# EAGLE board gdp (EAGLE 4.11)
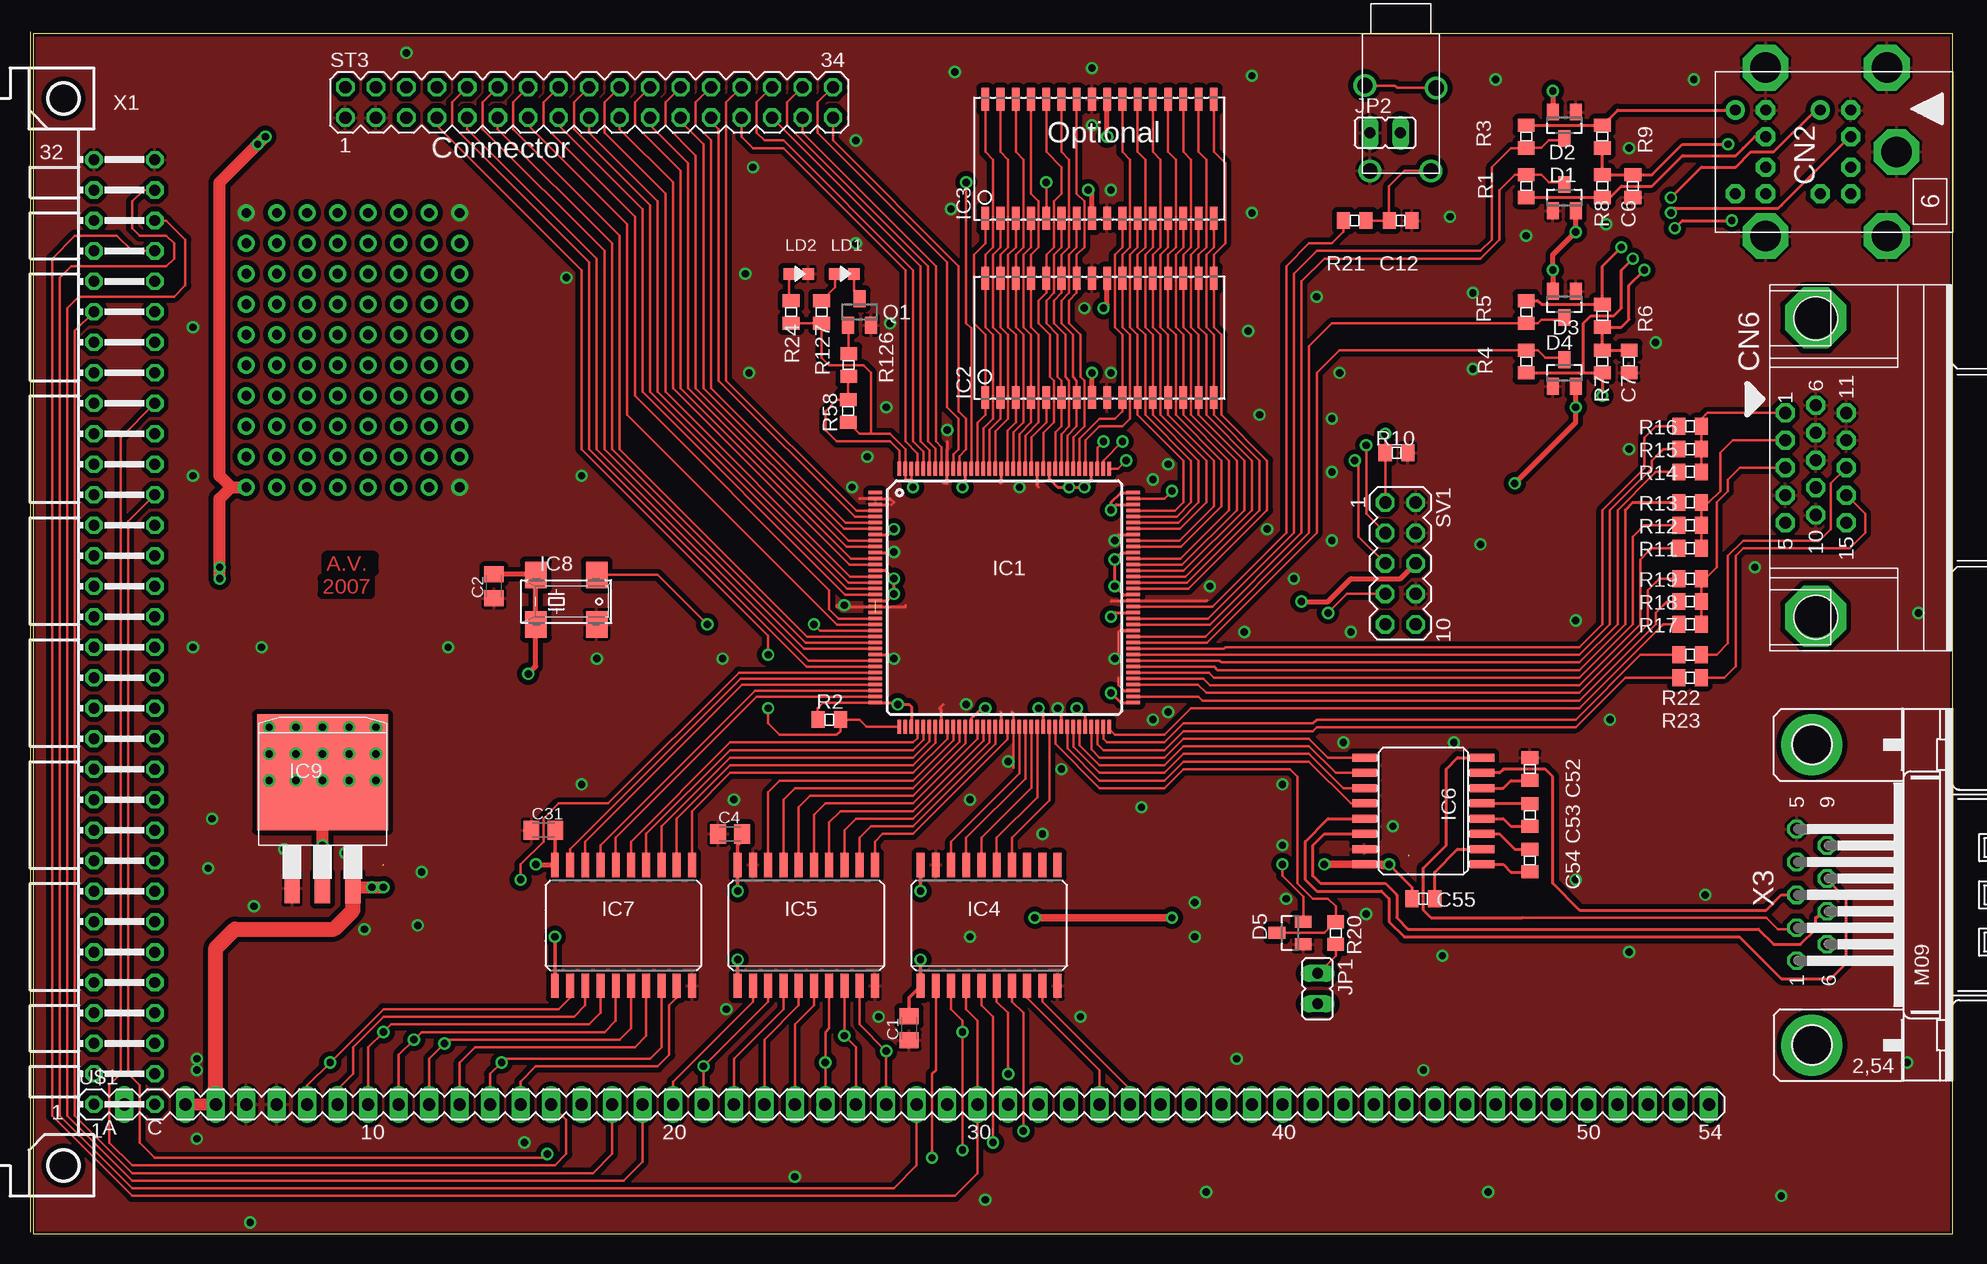
[diagram p2: board, top side]
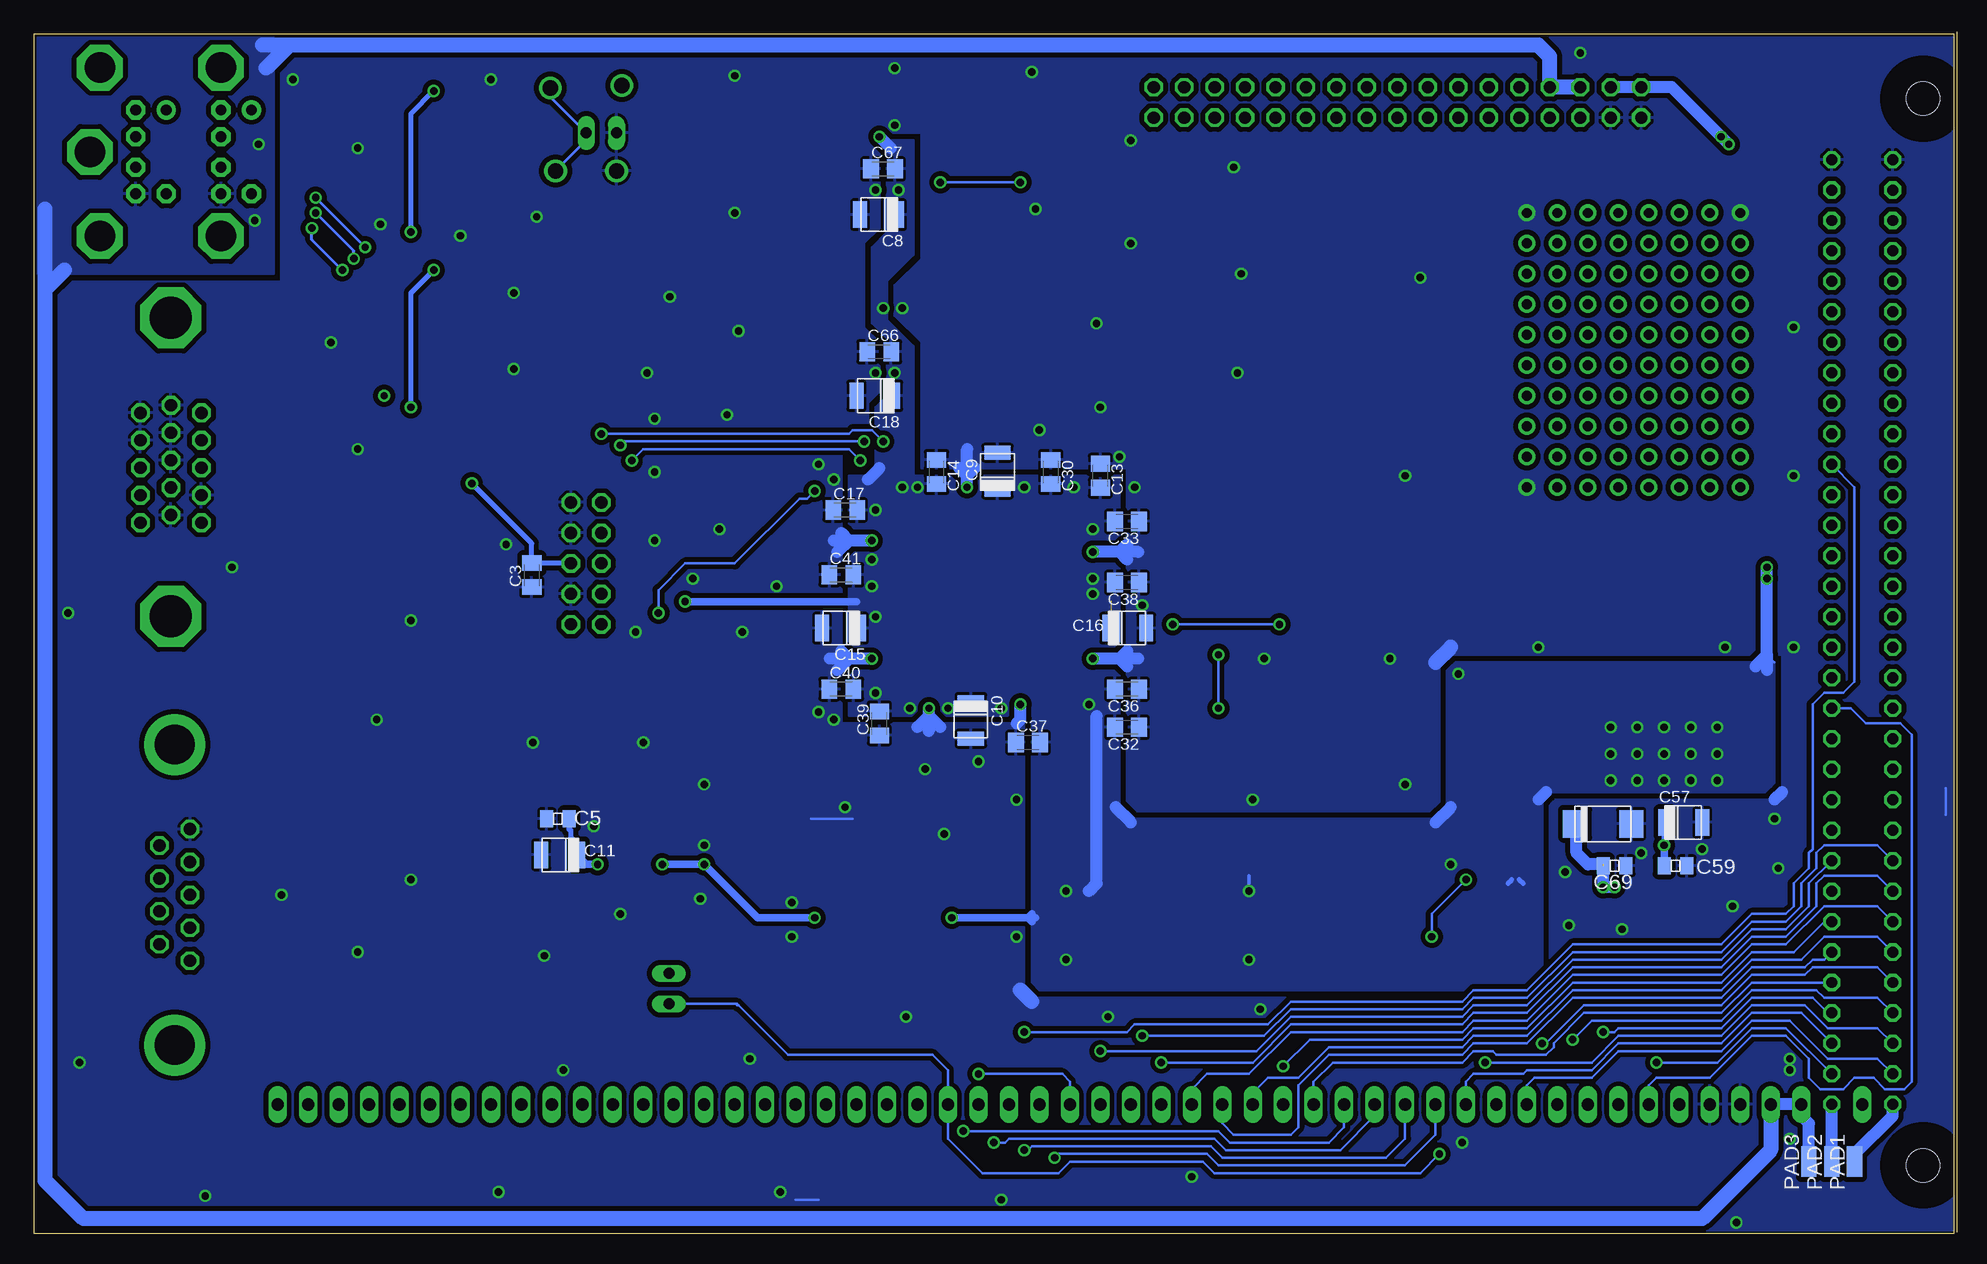
[diagram p3: board, bottom side, seen from below]

Size 160 x 100 mm. Coordinates in mm from the lower left corner, seen from the top.
Outline: 0,0 160,0 160,100 0,100 0,0
Copper layers (1*16): Top 0.035mm / dielectric 1.5mm / Bottom 0.035mm
Design rules "default": minimum track width 8mil, minimum drill 24mil, track to track 8mil, track to pad 8mil, pad to pad 8mil, via to via 8mil, smd to smd 8mil, copper to edge 0mil, drill to drill 8mil, minimum pad ring 10mil, minimum via ring 8mil, stop-mask expansion 4mil, vias tented up to drill 30mil, thermal gap 10mil

## Footprints (pad centres in the part's own frame; a part is rotated, then mirrored left to right if it is on the bottom)
C0805K = smd 1.3 x 1.6: 1 -1,0; 2 1,0
0805 = smd 1.092 x 1.397: 1 -0.94,0; 2 0.94,0
TANT_B = smd 1.15 x 2.2: 1 -1.473,0; 2 1.6,0
TANT_C = smd 2 x 2.3: 1 -2.032,0; 2 2.667,0
KLINKE3,5 = drill 1.27 round: 1 4.31,0.2; 2 11.43,0.635; 3 11.43,5.715; 4 4.51,6.15
MINIDIN_6POL_DOUBLE = drill 0.914 pad 1.6 octagon: A1 1.27,-8.5; A2 -1.27,-8.5; A3 3.493,-8.5; A4 -3.493,-8.5; A5 3.493,-11.04; B1 1.27,-15.6; B2 -1.27,-15.6; B3 3.493,-15.6; B4 -3.493,-15.6; B5 3.493,-18.14 | drill 0.914 pad 1.6 round: A6 -3.493,-11.04; B6 -3.493,-18.14 | drill 2.54 pad 3.81 octagon: SH1 0,-4.69; SH2 -7.018,-5.5; SH3 7.018,-5.5; SH4 -7.018,-15.6; SH5 7.018,-15.6
D-HD15F2 = drill 1.016 pad 1.575 octagon: 1 -4.826,-2.54; 2 -2.54,-2.54; 3 -0.254,-2.54; 4 2.032,-2.54; 5 4.318,-2.54; 6 -5.461,0; 7 -3.175,0; 8 -0.889,0; 9 1.397,0; 10 3.683,0; 11 -4.826,2.54; 12 -2.54,2.54; 13 -0.254,2.54; 14 2.032,2.54; 15 4.318,2.54 | drill 3.5 pad 5.08 octagon: PAD1 -12.754,0; PAD2 12.138,0
SOT23 = smd 1 x 1.4: 1 -0.95,-1.1; 2 0.95,-1.1; 3 0,1.1
TQFP144 = smd 1.143 x 0.297: 1 -10.75,8.75; 2 -10.75,8.25; 3 -10.75,7.75; 4 -10.75,7.25; 5 -10.75,6.75; 6 -10.75,6.25; 7 -10.75,5.75; 8 -10.75,5.25; 9 -10.75,4.75; 10 -10.75,4.25; 11 -10.75,3.75; 12 -10.75,3.25; 13 -10.75,2.75; 14 -10.75,2.25; 15 -10.75,1.75; 16 -10.75,1.25; 17 -10.75,0.75; 18 -10.75,0.25; 19 -10.75,-0.25; 20 -10.75,-0.75; 21 -10.75,-1.25; 22 -10.75,-1.75; 23 -10.75,-2.25; 24 -10.75,-2.75; 25 -10.75,-3.25; 26 -10.75,-3.75; 27 -10.75,-4.25; 28 -10.75,-4.75; 29 -10.75,-5.25; 30 -10.75,-5.75; 31 -10.75,-6.25; 32 -10.75,-6.75; 33 -10.75,-7.25; 34 -10.75,-7.75; 35 -10.75,-8.25; 36 -10.75,-8.75; 73 10.75,-8.75; 74 10.75,-8.25; 75 10.75,-7.75; 76 10.75,-7.25; 77 10.75,-6.75; 78 10.75,-6.25; 79 10.75,-5.75; 80 10.75,-5.25; 81 10.75,-4.75; 82 10.75,-4.25; 83 10.75,-3.75; 84 10.75,-3.25; 85 10.75,-2.75; 86 10.75,-2.25; 87 10.75,-1.75; 88 10.75,-1.25; 89 10.75,-0.75; 90 10.75,-0.25; 91 10.75,0.25; 92 10.75,0.75; 93 10.75,1.25; 94 10.75,1.75; 95 10.75,2.25; 96 10.75,2.75; 97 10.75,3.25; 98 10.75,3.75; 99 10.75,4.25; 100 10.75,4.75; 101 10.75,5.25; 102 10.75,5.75; 103 10.75,6.25; 104 10.75,6.75; 105 10.75,7.25; 106 10.75,7.75; 107 10.75,8.25; 108 10.75,8.75 | smd 0.297 x 1.143: 37 -8.75,-10.75; 38 -8.25,-10.75; 39 -7.75,-10.75; 40 -7.25,-10.75; 41 -6.75,-10.75; 42 -6.25,-10.75; 43 -5.75,-10.75; 44 -5.25,-10.75; 45 -4.75,-10.75; 46 -4.25,-10.75; 47 -3.75,-10.75; 48 -3.25,-10.75; 49 -2.75,-10.75; 50 -2.25,-10.75; 51 -1.75,-10.75; 52 -1.25,-10.75; 53 -0.75,-10.75; 54 -0.25,-10.75; 55 0.25,-10.75; 56 0.75,-10.75; 57 1.25,-10.75; 58 1.75,-10.75; 59 2.25,-10.75; 60 2.75,-10.75; 61 3.25,-10.75; 62 3.75,-10.75; 63 4.25,-10.75; 64 4.75,-10.75; 65 5.25,-10.75; 66 5.75,-10.75; 67 6.25,-10.75; 68 6.75,-10.75; 69 7.25,-10.75; 70 7.75,-10.75; 71 8.25,-10.75; 72 8.75,-10.75; 109 8.75,10.75; 110 8.25,10.75; 111 7.75,10.75; 112 7.25,10.75; 113 6.75,10.75; 114 6.25,10.75; 115 5.75,10.75; 116 5.25,10.75; 117 4.75,10.75; 118 4.25,10.75; 119 3.75,10.75; 120 3.25,10.75; 121 2.75,10.75; 122 2.25,10.75; 123 1.75,10.75; 124 1.25,10.75; 125 0.75,10.75; 126 0.25,10.75; 127 -0.25,10.75; 128 -0.75,10.75; 129 -1.25,10.75; 130 -1.75,10.75; 131 -2.25,10.75; 132 -2.75,10.75; 133 -3.25,10.75; 134 -3.75,10.75; 135 -4.25,10.75; 136 -4.75,10.75; 137 -5.25,10.75; 138 -5.75,10.75; 139 -6.25,10.75; 140 -6.75,10.75; 141 -7.25,10.75; 142 -7.75,10.75; 143 -8.25,10.75; 144 -8.75,10.75
SOJ32/4 = smd 0.635 x 1.905: 1 -8.89,-4.902; 2 -7.62,-4.902; 3 -6.35,-4.902; 4 -5.08,-4.902; 5 -3.81,-4.902; 6 -2.54,-4.902; 7 -1.27,-4.902; 8 0,-4.902; 9 1.27,-4.902; 10 2.54,-4.902; 11 3.81,-4.902; 12 5.08,-4.902; 13 6.35,-4.902; 14 7.62,-4.902; 15 8.89,-4.902; 16 10.16,-4.902; 17 10.16,5.029; 18 8.89,5.029; 19 7.62,5.029; 20 6.35,5.029; 21 5.08,5.029; 22 3.81,5.029; 23 2.54,5.029; 24 1.27,5.029; 25 0,5.029; 26 -1.27,5.029; 27 -2.54,5.029; 28 -3.81,5.029; 29 -5.08,5.029; 30 -6.35,5.029; 31 -7.62,5.029; 32 -8.89,5.029
SO20W = smd 0.66 x 2.032: 1 -5.715,-5.029; 2 -4.445,-5.029; 3 -3.175,-5.029; 4 -1.905,-5.029; 5 -0.635,-5.029; 6 0.635,-5.029; 7 1.905,-5.029; 8 3.175,-5.029; 9 4.445,-5.029; 10 5.715,-5.029; 11 5.715,5.029; 12 4.445,5.029; 13 3.175,5.029; 14 1.905,5.029; 15 0.635,5.029; 16 -0.635,5.029; 17 -1.905,5.029; 18 -3.175,5.029; 19 -4.445,5.029; 20 -5.715,5.029
SO16L = smd 0.66 x 2.032: 1 -4.445,-4.902; 2 -3.175,-4.902; 3 -1.905,-4.902; 4 -0.635,-4.902; 5 0.635,-4.902; 6 1.905,-4.902; 7 3.175,-4.902; 8 4.445,-4.902; 9 4.445,4.902; 10 3.175,4.902; 11 1.905,4.902; 12 0.635,4.902; 13 -0.635,4.902; 14 -1.905,4.902; 15 -3.175,4.902; 16 -4.445,4.902
CRYSTAL = smd 1.8 x 2.2: 1 -2.54,-2.857; 2 2.54,-2.857; 3 2.54,1.27; 4 -2.54,1.27
3LEAD_DD = smd 1.27 x 2.54: 1 -2.54,-3.556; 2 0,-3.556; 3 2.54,-3.556 | smd 10.922 x 9.652: 2@1 0,6.096
JP1 = drill 0.914 long: 1 0,-1.27; 2 0,1.27
0603LED = smd 0.965 x 0.965: 1 -0.787,0; 2 0.787,0
SMD2 = smd 1.27 x 2.54: 1 0,0
MA17-2 = drill 1.016 octagon: 1 -20.32,-1.27; 2 -20.32,1.27; 3 -17.78,-1.27; 4 -17.78,1.27; 5 -15.24,-1.27; 6 -15.24,1.27; 7 -12.7,-1.27; 8 -12.7,1.27; 9 -10.16,-1.27; 10 -10.16,1.27; 11 -7.62,-1.27; 12 -7.62,1.27; 13 -5.08,-1.27; 14 -5.08,1.27; 15 -2.54,-1.27; 16 -2.54,1.27; 17 0,-1.27; 18 0,1.27; 19 2.54,-1.27; 20 2.54,1.27; 21 5.08,-1.27; 22 5.08,1.27; 23 7.62,-1.27; 24 7.62,1.27; 25 10.16,-1.27; 26 10.16,1.27; 27 12.7,-1.27; 28 12.7,1.27; 29 15.24,-1.27; 30 15.24,1.27; 31 17.78,-1.27; 32 17.78,1.27; 33 20.32,-1.27; 34 20.32,1.27
MA05-2 = drill 1.016 octagon: 1 -5.08,-1.27; 2 -5.08,1.27; 3 -2.54,-1.27; 4 -2.54,1.27; 5 0,-1.27; 6 0,1.27; 7 2.54,-1.27; 8 2.54,1.27; 9 5.08,-1.27; 10 5.08,1.27
NKC-BUS = drill 1.016 long: 2 2.54,0; 4 7.62,0; 5 10.16,0; 6 12.7,0; 7 15.24,0; 8 17.78,0; 9 20.32,0; 10 22.86,0; 11 25.4,0; 12 27.94,0; 13 30.48,0; 14 33.02,0; 15 35.56,0; 16 38.1,0; 17 40.64,0; 18 43.18,0; 19 45.72,0; 20 48.26,0; 21 50.8,0; 22 53.34,0; 23 55.88,0; 24 58.42,0; 25 60.96,0; 26 63.5,0; 27 66.04,0; 28 68.58,0; 29 71.12,0; 30 73.66,0; 31 76.2,0; 32 78.74,0; 33 81.28,0; 34 83.82,0; 35 86.36,0; 36 88.9,0; 37 91.44,0; 38 93.98,0; 39 96.52,0; 40 99.06,0; 41 101.6,0; 42 104.14,0; 43 106.68,0; 44 109.22,0; 45 111.76,0; 46 114.3,0; 47 116.84,0; 48 119.38,0; 49 121.92,0; 50 124.46,0; 51 127,0; 52 129.54,0; 53 132.08,0; 54 134.62,0
ML64ECB = drill 0.914 octagon: 10C -7.62,16.51; 11C -7.62,13.97; 12A -2.54,11.43; 12C -7.62,11.43; 13A -2.54,8.89; 13C -7.62,8.89; 14A -2.54,6.35; 15A -2.54,3.81; 15C -7.62,3.81; 16A -2.54,1.27; 16C -7.62,1.27; 17A -2.54,-1.27; 19A -2.54,-6.35; 19C -7.62,-6.35; 21A -2.54,-11.43; 22A -2.54,-13.97; 23A -2.54,-16.51; 23C -7.62,-16.51; 24A -2.54,-19.05; 25A -2.54,-21.59; 26A -2.54,-24.13; 26C -7.62,-24.13; +5V -2.54,39.37; +5V@1 -7.62,39.37; A0 -7.62,29.21; A1 -7.62,24.13; A2 -2.54,26.67; A3 -7.62,26.67; A4 -2.54,24.13; A5 -2.54,21.59; A6 -2.54,19.05; A7 -7.62,19.05; A8 -7.62,21.59; A9 -2.54,-34.29; A10 -7.62,-3.81; A11 -7.62,-1.27; A12 -7.62,-26.67; A13 -2.54,-31.75; A14 -2.54,-3.81; A15 -7.62,-29.21; BUSAK -2.54,-36.83; BUSRQ -2.54,13.97; CLK -7.62,-31.75; D0 -7.62,36.83; D1 -7.62,6.35; D2 -7.62,31.75; D3 -2.54,31.75; D4 -2.54,29.21; D5 -2.54,36.83; D6 -2.54,34.29; D7 -7.62,34.29; GND -2.54,-39.37; GND@1 -7.62,-39.37; HALT -7.62,-21.59; INT -7.62,-11.43; IORQ -2.54,-26.67; M1 -2.54,-8.89; MREQ -7.62,-34.29; NMI -7.62,-8.89; RD -7.62,-19.05; RESET -7.62,-36.83; RFSH -2.54,-29.21; WAIT -2.54,16.51; WR -7.62,-13.97 | hole 2.794: 0,44.45; 0,-44.45
M09HP = drill 1.016 octagon: 1 5.486,-1.27; 2 2.743,-1.27; 3 0,-1.27; 4 -2.743,-1.27; 5 -5.486,-1.27; 6 4.115,1.27; 7 1.372,1.27; 8 -1.372,1.27; 9 -4.115,1.27 | drill 3.302 pad 5.08 round: G1 12.522,0; G2 -12.522,0

## Placement (x,y rotation side)
C1  100n  [C0805K]  73.03,17.14 90 top
C2  100n  [C0805K]  38.42,53.98 90 top
C3  100n  [C0805K]  118.51,54.9 90 bottom
C4  100n  [C0805K]  58.1,33.34 0 top
C5  100n  [0805]  116.33,34.61 0 bottom
C6  100n  [0805]  133.35,87.31 90 top
C7  100n  [0805]  133.03,72.71 90 top
C8  10µF  [TANT_B]  89.55,84.95 180 bottom
C9  10µF  [TANT_B]  79.69,63.5 90 bottom
C10  10µF  [TANT_B]  81.92,42.86 270 bottom
C11  10µF  [TANT_B]  116.12,31.59 180 bottom
C12  4n7  [0805]  113.98,84.45 180 top
C13  100n  [C0805K]  71.12,63.18 270 bottom
C14  100n  [C0805K]  84.77,63.5 270 bottom
C15  10µF  [TANT_B]  92.71,50.48 180 bottom
C16  10µF  [TANT_B]  68.9,50.48 0 bottom
C17  100n  [C0805K]  92.39,60.33 0 bottom
C18  10µF  [TANT_B]  89.85,69.85 180 bottom
C30  100n  [C0805K]  75.25,63.5 270 bottom
C31  100n  [C0805K]  42.55,33.66 0 top
C32  100n  [C0805K]  68.9,42.23 180 bottom
C33  100n  [C0805K]  68.9,59.37 180 bottom
C36  100n  [C0805K]  68.9,45.4 180 bottom
C37  100n  [C0805K]  77.15,40.96 0 bottom
C38  100n  [C0805K]  68.9,54.29 180 bottom
C39  100n  [C0805K]  89.53,42.55 90 bottom
C40  100n  [C0805K]  92.71,45.4 0 bottom
C41  100n  [C0805K]  92.71,54.93 0 bottom
C52  100n  [0805]  124.78,38.73 270 top
C53  100n  [0805]  124.78,34.92 270 top
C54  100n  [0805]  124.78,31.11 270 top
C55  100n  [0805]  115.89,27.94 180 top
C57  10µF  [TANT_B]  22.54,34.29 0 bottom
C59  100n  [0805]  23.18,30.68 180 bottom
C63  10µF/16V  [TANT_C]  29.53,34.18 0 bottom
C66  100n  [C0805K]  89.55,73.52 0 bottom
C67  100n  [C0805K]  89.23,88.76 0 bottom
C69  100n  [0805]  28.26,30.68 180 bottom
CN1  LINE OUT  [KLINKE3,5]  110.81,100.01 270 top
CN2  [MINIDIN_6POL_DOUBLE]  160.02,90.17 270 top
CN6  VGA15  [D-HD15F2]  148.59,63.59 270 top
D1  BAT54S  [SOT23]  127.64,86.36 0 top
D2  BAT54S  [SOT23]  127.64,92.39 180 top
D3  BAT54S  [SOT23]  127.64,77.47 180 top
D4  BAT54S  [SOT23]  127.64,71.75 0 top
D5  BAT54S  [SOT23]  104.78,25.08 90 top
IC1  LFXP6KC-T144  [TQFP144]  80.96,53.02 0 top
IC2  CY7C1019CV33-12VC  [SOJ32/4]  88.27,74.61 0 top
IC3  CY7C1019CV33-12VC  [SOJ32/4]  88.27,89.53 0 top
IC4  74LVC245  [SO20W]  79.69,25.72 0 top
IC5  74LVC245  [SO20W]  64.45,25.72 0 top
IC6  MAX3232CSE  [SO16L]  115.89,35.24 90 top
IC7  74LVC245  [SO20W]  49.21,25.72 0 top
IC8  40MHz  [CRYSTAL]  44.45,53.66 0 top
IC9  LT1086CM-3.3  [3LEAD_DD]  24.13,32.38 0 top
JP1  [JP1]  107.08,20.44 180 top
JP2  [JP1]  112.71,91.76 270 top
LD1  gelb  [0603LED]  67.63,80.01 0 top
LD2  Grün  [0603LED]  63.82,80.01 0 top
PAD1  [SMD2]  8.26,6.03 0 bottom
PAD2  [SMD2]  10.16,6.03 0 bottom
PAD3  [SMD2]  12.06,6.03 0 bottom
Q1  BSS138  [SOT23]  68.9,76.83 0 top
R1  120  [0805]  124.46,87.31 270 top
R2  4k7  [0805]  66.36,42.86 180 top
R3  120  [0805]  124.46,91.44 90 top
R4  120  [0805]  124.46,72.71 270 top
R5  120  [0805]  124.46,76.83 90 top
R6  2k  [0805]  130.81,76.52 270 top
R7  2k  [0805]  130.81,72.71 90 top
R8  2k  [0805]  130.81,87.31 90 top
R9  2k  [0805]  130.81,91.44 270 top
R10  4k7  [0805]  113.64,65.11 180 top
R11  470  [0805]  138.11,57.15 180 top
R12  1k  [0805]  138.11,59.05 180 top
R13  1k8  [0805]  138.11,60.96 180 top
R14  470  [0805]  138.11,63.5 180 top
R15  1k  [0805]  138.11,65.41 180 top
R16  1k8  [0805]  138.11,67.31 180 top
R17  470  [0805]  138.11,50.8 180 top
R18  1k  [0805]  138.11,52.7 180 top
R19  1k8  [0805]  138.11,54.61 180 top
R20  120R  [0805]  108.58,25.08 90 top
R21  3k3  [0805]  110.17,84.45 180 top
R22  47  [0805]  138.11,48.26 180 top
R23  47  [0805]  138.11,46.35 180 top
R24  270R  [0805]  63.18,76.83 270 top
R58  10k  [0805]  67.94,68.58 270 top
R126  5K6  [0805]  67.99,72.42 90 top
R127  220R  [0805]  65.72,76.83 270 top
ST3  [MA17-2]  46.35,94.3 0 top
SV1  [MA05-2]  113.98,55.88 270 top
U$1  NKC-BUS  [NKC-BUS]  5.08,10.79 0 top
X1  ECB64  [ML64ECB]  2.54,50.16 180 top
X3  DB9-M  [M09HP]  148.27,28.26 270 top

## Tracks (layer width: path | path; a pad name or v marks a point on that pad's centre or on a via)
/BUS_INT  (via drill 0.61)
  Top 0.203: X1.INT 7.94,59.37 7.94,13.34 8.89,12.38 8.89,7.62 10.16,6.35 42.55,6.35 v42.86,6.67
  Bottom 0.203: JP1.2 101.4,19.17 101.4,19.05 101.28,19.05 97.16,14.92 85.09,14.92 83.82,13.65 U$1.32 83.82,7.94 80.96,5.08 74.61,5.08 73.66,6.03 62.55,6.03 61.59,5.08 44.45,5.08 v42.86,6.67
A0
  Top 0.203: 60.01,20.32 60.01,20 | 60.01,20.32 IC5.2 | 60.01,20.32 60.01,19.37 53.34,12.7 U$1.20
  Bottom 0.203: X1.A0 16.83,20.95 19.37,18.41 30.8,18.41 33.34,15.88 33.34,15.56 33.97,14.92 38.1,14.92 38.42,15.24 40.01,15.24 40.96,14.29 51.75,14.29 53.34,12.7 U$1.20
A1  (via drill 0.61)
  Top 0.203: IC5.3 61.28,19.37 v55.88,13.97 U$1.21
  Bottom 0.203: X1.A1 10.79,26.04 13.34,23.5 16.83,23.5 19.37,20.95 31.75,20.95 35.56,17.14 40.01,17.14 40.96,16.19 53.66,16.19 v55.88,13.97
A2
  Top 0.203: IC5.4 62.55,18.73 58.42,14.61 U$1.22
  Bottom 0.203: X1.A2 6.35,24.77 10.79,24.77 12.7,22.86 16.83,22.86 19.37,20.32 31.75,20.32 35.56,16.51 40.01,16.51 40.96,15.56 52.07,15.56 54.61,13.02 57.15,13.02 58.42,11.75 U$1.22
A3
  Top 0.203: IC5.5 63.82,19.05 60.96,16.19 U$1.23
  Bottom 0.203: X1.A3 10.79,22.86 11.75,22.86 12.38,22.23 16.83,22.23 19.37,19.68 31.75,19.68 35.56,15.88 40.01,15.88 40.96,14.92 52.07,14.92 54.61,12.38 54.61,8.89 55.24,8.26 60.01,8.26 60.96,9.21 U$1.23
A4
  Top 0.203: IC5.6 65.09,19.05 63.5,17.46 U$1.24
  Bottom 0.203: X1.A4 6.35,27.3 10.79,27.3 13.97,24.13 16.83,24.13 19.37,21.59 31.75,21.59 35.56,17.78 40.01,17.78 40.96,16.83 55.24,16.83 58.74,13.34 62.23,13.34 63.5,12.06 U$1.24
A5  (via drill 0.61)
  Top 0.203: U$1.25 v66.04,14.29 66.04,16.83 66.36,17.14 IC5.7
  Bottom 0.203: X1.A5 6.35,29.84 10.79,29.84 11.43,29.21 11.43,27.3 13.97,24.77 16.83,24.77 19.37,22.23 31.75,22.23 35.56,18.41 40.01,18.41 40.96,17.46 55.24,17.46 58.42,14.29 v66.04,14.29
A6  (via drill 0.61)
  Top 0.203: U$1.26 68.58,15.56 v67.63,16.51 IC5.8
  Bottom 0.203: X1.A6 6.35,32.38 10.79,32.38 11.43,31.75 11.43,30.48 12.7,29.21 12.7,27.3 13.97,26.04 16.83,26.04 19.37,23.5 31.75,23.5 35.56,19.68 40.01,19.68 40.96,18.73 55.24,18.73 57.47,16.51 v67.63,16.51
A7  (via drill 0.61)
  Top 0.203: U$1.27 v71.12,15.24 68.9,17.46 IC5.9
  Bottom 0.203: v71.12,15.24 58.1,15.24 55.24,18.1 40.96,18.1 40.01,19.05 35.56,19.05 31.75,22.86 19.37,22.86 16.83,25.4 13.97,25.4 12.06,27.3 12.06,29.21 X1.A7
A8
  Top 0.203: IC4.8 82.87,19.68 88.9,13.65 U$1.34
A9
  Top 0.203: U$1.35 91.44,12.06 84.14,19.37 IC4.9
AUDIO
  Top 0.203: IC1.89 98.31,52.27 104.46,58.42 104.46,80.64 106.36,82.55 108.27,82.55 109.23,83.52 R21.2
BLAU
  Top 0.203: R17.1 139.06,50.8 139.05,50.81 R18.1 139.06,52.7 139.05,52.72 R19.1 139.38,54.61 140.34,55.56 140.34,60.96 141.29,61.91 141.29,62.87 142.27,63.85 CN6.3
CLK
  Top 0.203: X1.CLK 8.26,81.92 6.99,83.19 3.49,83.19 1.59,81.28 1.59,9.84 8.26,3.17 76.83,3.17 78.74,5.08 U$1.30 78.74,17.78 77.79,18.73 IC4.4
CTS_FPGA
  Top 0.203: IC6.12 109.86,35.88 106.36,39.37 95.89,39.37 94.3,37.78 88.9,37.78 86.21,40.47 IC1.65
D0  (via drill 0.61)
  Top 0.203: IC7.2 44.77,19.68 43.81,18.73 29.21,18.73 v24.77,14.29 22.86,12.38 22.86,11.11 | 22.86,11.11 U$1.8 | 22.86,11.11 22.86,11.43
  Bottom 0.203: X1.D0 13.97,17.14 16.83,17.14 19.68,14.29 v24.77,14.29
D1
  Top 0.203: IC7.3 46.04,19.05 45.09,18.1 29.21,18.1 26.67,15.56 26.67,13.34 25.4,12.06 U$1.9
  Bottom 0.203: 9.53,43.81 X1.D1 8.57,43.81 7.3,42.55 4.45,42.55 3.49,41.59 3.49,12.7 4.13,12.06 5.71,12.06 6.67,13.02 8.26,13.02 9.21,12.06 11.11,12.06 12.06,13.02 12.06,14.61 13.97,16.51 16.83,16.51 20.32,13.02 24.77,13.02 25.4,12.38 U$1.9
D2  (via drill 0.61)
  Top 0.203: U$1.10 27.94,15.56 v29.21,16.83 29.84,17.46 46.35,17.46 47.31,18.41 IC7.4
  Bottom 0.203: X1.D2 10.48,18.41 11.75,19.68 16.83,19.68 19.37,17.14 27.94,17.14 28.26,16.83 v29.21,16.83
D3  (via drill 0.61)
  Top 0.203: IC7.5 48.58,17.78 47.62,16.83 32.38,16.83 v31.75,16.19 30.48,14.92 U$1.11
  Bottom 0.203: X1.D3 6.35,19.68 10.79,19.68 11.43,20.32 16.83,20.32 19.37,17.78 30.16,17.78 v31.75,16.19
D4  (via drill 0.61)
  Top 0.203: U$1.12 33.02,14.61 v34.29,15.88 34.61,16.19 48.9,16.19 49.85,17.14 IC7.6
  Bottom 0.203: X1.D4 6.35,22.23 11.75,22.23 12.38,21.59 16.83,21.59 19.37,19.05 30.8,19.05 33.97,15.88 v34.29,15.88
D5
  Top 0.203: IC7.7 51.12,16.51 50.16,15.56 36.83,15.56 35.56,14.29 U$1.13
  Bottom 0.203: X1.D5 6.35,14.61 10.48,14.61 13.65,17.78 16.83,17.78 19.37,15.24 27.94,15.24 30.16,13.02 34.92,13.02 35.56,12.38 U$1.13
D6  (via drill 0.61)
  Top 0.203: U$1.14 38.1,13.34 v39.05,14.29 39.37,14.61 51.44,14.61 52.39,15.56 IC7.8
  Bottom 0.203: X1.D6 6.35,17.14 10.48,17.14 12.38,19.05 16.83,19.05 19.37,16.51 27.94,16.51 30.16,14.29 v39.05,14.29
D7
  Top 0.203: U$1.15 40.64,12.7 41.91,13.97 52.07,13.97 53.02,14.92 53.02,19.05 53.66,19.68 IC7.9
  Bottom 0.203: X1.D7 12.7,18.41 16.83,18.41 19.37,15.88 27.94,15.88 30.16,13.65 35.56,13.65 35.88,13.34 40.01,13.34 40.64,12.7 U$1.15
DONE
  Top 0.203: R126.1 67.94,71.47 67.94,69.53 | IC1.144 72.21,65.27 71.44,66.04 66.99,66.04 66.04,66.99 66.04,68.58 66.99,69.53 67.94,69.53 | 67.94,69.53 R58.1
EXT0
  Top 0.203: ST3.10 34.92,94.3 34.92,92.39 46.35,80.96 46.35,65.41 64.49,47.27 IC1.30
EXT1
  Top 0.203: IC1.29 64.62,47.77 46.99,65.41 46.99,81.28 36.2,92.08 ST3.9
EXT2
  Top 0.203: ST3.12 37.47,94.3 37.47,92.08 47.62,81.92 47.62,65.41 64.26,48.77 IC1.27
EXT3
  Top 0.203: IC1.26 64.39,49.27 48.26,65.41 48.26,82.55 38.73,92.08 ST3.11
EXT4
  Top 0.203: ST3.14 40.01,94.3 40.01,92.08 48.9,83.19 48.9,65.41 64.53,49.77 IC1.25
EXT5
  Top 0.203: IC1.23 67.02,50.77 49.53,68.26 49.53,84.14 41.27,92.39 ST3.13
EXT6
  Top 0.203: ST3.16 42.55,94.3 42.55,92.39 50.16,84.77 50.16,69.85 66.36,53.66 66.36,52.07 67.16,51.27 IC1.22
EXT7
  Top 0.203: IC1.18 67.69,53.27 50.8,70.17 50.8,85.41 43.81,92.39 ST3.15
EXT8
  Top 0.203: IC1.17 67.83,53.77 51.44,70.17 51.44,85.72 45.09,92.08 45.09,94.3 ST3.18
EXT9
  Top 0.203: IC1.16 67.97,54.27 52.07,70.17 52.07,86.04 46.35,91.76 ST3.17
EXT10
  Top 0.203: IC1.15 68.1,54.77 52.7,70.17 52.7,86.68 47.62,91.76 47.62,94.3 ST3.20
EXT11
  Top 0.203: IC1.13 68.05,55.77 53.34,70.48 53.34,87.63 48.9,92.08 ST3.19
EXT12
  Top 0.203: ST3.22 50.16,94.3 50.16,92.39 53.98,88.58 53.98,70.48 68.19,56.27 IC1.12
EXT13
  Top 0.203: IC1.10 67.82,57.27 54.61,70.48 54.61,89.22 51.44,92.39 ST3.21
EXT14
  Top 0.203: ST3.24 52.7,94.3 52.7,92.39 55.24,89.85 55.24,70.48 67.96,57.77 IC1.9
EXT15
  Top 0.203: IC1.7 67.59,58.77 55.88,70.48 55.88,90.81 53.98,92.71 ST3.23
EXT16
  Top 0.203: IC1.6 67.73,59.27 56.52,70.48 56.52,91.12 55.24,92.39 55.24,94.3 ST3.26
EXT17
  Top 0.203: IC1.5 68.5,59.77 57.15,71.12 57.15,92.08 56.52,92.71 ST3.25
EXT18
  Top 0.203: IC1.4 68.63,60.27 57.78,71.12 57.78,94.3 ST3.28
EXT19
  Top 0.203: ST3.27 59.05,91.44 60.01,90.49 62.55,90.49 72.71,80.33 72.71,66.04 73.71,65.03 IC1.141
EXT20
  Top 0.203: ST3.30 60.33,94.3 60.33,91.76 60.96,91.12 62.55,91.12 73.34,80.33 73.34,66.04 74.21,65.17 IC1.140
EXT21
  Top 0.203: ST3.29 73.98,80.64 73.98,66.04 74.71,65.31 IC1.139
EXT22
  Top 0.203: ST3.32 62.87,94.3 62.87,92.39 74.61,80.64 74.61,66.04 75.21,65.44 IC1.138
EXT23
  Top 0.203: ST3.31 64.14,91.76 75.25,80.64 75.25,66.04 75.71,65.58 IC1.137
EXT24
  Top 0.203: ST3.34 65.41,94.3 65.41,91.76 76.2,80.96 76.2,68.9 77.15,67.94 77.15,65.41 76.71,64.97 IC1.135
EXT25
  Top 0.203: ST3.33 66.67,91.12 77.15,80.64 77.15,68.58 77.79,67.94 77.79,65.41 77.21,64.83 IC1.134
F_TCK  (via drill 0.61)
  Top 0.203: IC1.111 88.71,65.53 v89.22,66.04 | v112.71,66.67 112.71,65.09 | R10.2 SV1.1
  Top 0.254: 112.71,65.09 112.7,65.09 R10.2 | SV1.1
  Bottom 0.203: v112.71,66.67 92.08,66.67 91.76,66.99 90.17,66.99 v89.22,66.04
F_TDI  (via drill 0.61)
  Top 0.203: IC1.109 90.44,63.77 v91.12,64.45 | SV1.5 110.49,58.1 110.49,64.14 v110.17,64.45
  Bottom 0.203: v91.12,64.45 92.08,65.41 109.22,65.41 v110.17,64.45
F_TDO  (via drill 0.61)
  Top 0.203: SV1.7 109.54,53.34 v107.95,51.75 | IC1.107 94.29,61.27 v94.93,61.91
  Bottom 0.203: v107.95,51.75 107.95,53.66 105.73,55.88 101.6,55.88 96.2,61.28 95.57,61.28 v94.93,61.91
F_TMS  (via drill 0.61)
  Top 0.203: SV1.3 111.12,60.01 v111.12,65.72 | v90.81,66.04 89.22,64.45 89.22,63.82 89.21,63.82 IC1.110
  Bottom 0.203: v90.81,66.04 110.81,66.04 v111.12,65.72
GND  (via drill 0.61, 0.81 pad 1.42)
  Top 0.203: 90.49,58.1 90.49,58.27 | 83.71,62.34 83.82,62.23 | 80.64,62.55 80.71,62.62 | 75.88,62.55 76.04,62.71 76.21,62.88 | 71.44,61.28 71.43,61.27 71.44,61.27 71.75,60.96 71.57,60.77 | 68.9,61.27 68.9,61.28 | 75.71,43.67 75.56,43.81 | 80.71,43.43 80.64,43.5 | 90.94,45.27 90.49,45.72 90.49,46.35 | 90.49,48.26 90.49,50.16 90.59,50.27 90.7,50.27 90.81,50.27 | 71.75,48.27 71.75,48.26 | 66.99,52.27 66.99,52.39 | 72.71,52.27 72.71,52.39 | 81.71,38.85 IC1.56 81.71,43.38 81.6,43.5
  Top 0.254: 75.88,44.13 75.71,43.96 | IC1.11 71.38,56.77 71.44,56.83 | 90.49,58.27 IC1.101 | 83.71,62.34 IC1.121 | 80.71,62.62 IC1.127 | 71.43,61.27 IC1.2 68.9,61.27 | IC1.44 75.71,43.67 | IC1.54 80.71,43.43 | 90.94,45.27 IC1.75 | IC1.28 71.75,48.27 | 66.99,52.27 IC1.20 72.71,52.27 | 90.91,50.27 IC1.85 90.7,50.27 | IC1.64 85.71,43.48 | 97.86,52.77 IC1.90 89.92,52.77 89.85,52.7 | IC1.3 71.31,60.77 | IC2.9 89.55,69.71 | IC1.136 76.21,66.03 | 76.04,62.71 76.04,62.55 76.2,62.55 76.2,65.41
  Top 0.305: 85.71,43.48 85.72,43.5
  Top 0.406: D3.1 128.59,78.74
  Bottom 0.203: 91.76,34.61 95.25,34.61 | 0.64,34.92 0.64,37.15 | 94.61,2.86 96.52,2.86
  Bottom 1.016: v77.79,44.13 77.79,42.86 78.11,42.55 | 67.94,47.94 69.53,47.94 | 67.94,56.83 69.53,56.83 | 69.53,56.83 v71.75,56.83 | v82.23,62.23 82.23,65.41 | v90.17,57.78 92.08,57.78 | 92.08,57.78 93.34,57.78 | v90.17,47.94 92.08,47.94 | 92.08,47.94 93.66,47.94 | 85.41,43.18 85.41,41.91 | 85.41,43.18 v85.41,43.81 | 84.45,42.23 85.41,43.18 | 85.41,43.18 86.36,42.23 | 92.08,47.94 93.03,46.99 | 92.08,47.94 92.71,48.58 | 92.08,57.78 93.03,56.83 | 92.08,57.78 92.71,58.42 | 81.6,63.82 82.23,63.18 82.87,63.82 | 69.53,56.83 68.9,57.47 | 69.53,56.83 68.9,56.2 | 69.53,47.94 68.9,48.58 | 69.53,47.94 68.9,47.31 | 14.29,36.83 14.92,36.2 | 69.53,47.94 v71.75,47.94
  Bottom 1.27: 43.18,47.62 41.91,48.9 | 76.83,19.37 77.79,20.32
  other vias: 45.72,63.18 93.34,42.86 59.69,71.75 115.89,13.65 92.39,35.56 100.33,14.61 44.45,79.69 94.61,64.14 89.85,87 88.27,92.39 120.02,72.07 89.85,71.75 87.63,77.15 124.46,83.19 108.27,63.5 108.27,57.78 101.28,75.25 101.6,85.09 120.02,78.42 118.11,84.77 121.92,96.2 96.84,27.62 96.84,24.77 111.12,26.67 97.79,3.49 121.28,3.49 117.47,23.18 78.11,24.77 133.03,23.5 139.38,28.26 145.73,3.17 131.44,42.86 104.14,37.47 113.35,33.97 128.59,29.53 100.97,50.16 76.52,85.41 76.83,96.84 133.03,90.49 105.09,54.61 109.86,50.16 102.23,68.26 108.9,71.75 109.22,40.96 98.11,53.98 102.87,58.74 135.25,74.3 104.14,32.38 104.46,27.94 157.16,51.75 88.27,97.16 18.41,27.3 32.07,25.72 14.61,30.48 14.92,34.61 13.65,13.65 13.65,14.61 26.04,31.75 32.38,30.16 13.65,7.94 18.1,0.95 58.42,36.2 78.11,36.2 87.31,18.1 70.48,18.1 131.13,84.14 67.63,52.39 68.26,62.23 71.12,68.9 60.01,88.9 68.58,82.55 19.05,48.9 34.61,48.9 46.99,47.94 57.47,47.94 13.34,48.9 13.34,63.18 13.34,75.56 31.11,98.42 84.14,33.34 27.62,25.4 45.72,37.47 107,78.11 156.21,14.29 101.6,96.52 118.43,40.96 128.59,51.12 133.03,65.41 17.78,85.09 35.56,62.23 35.56,85.09 59.37,80.01 143.51,55.56 108.27,67.94 20.95,32.07 40.96,7.62 63.5,4.76 79.38,2.86 57.78,18.73 85.72,38.73 81.28,39.37 120.65,57.47 68.58,91.12 71.44,75.88 76.2,66.99 93.34,62.87 138.43,96.2 69.53,64.77 94.61,43.5
  pour Top (isolate 0.406): 0.32,0.32 159.7,0.32 159.7,99.69 0.32,99.69
  pour Bottom (isolate 0.406): 0,48.26 68.9,48.26 68.9,99.69 0,99.69
  pour Bottom (isolate 0.406): 67.63,63.82 86.04,63.82 86.04,100.01 67.63,99.69
  pour Bottom (isolate 0.406): 92.71,99.69 139.38,99.69 139.38,32.7 92.71,32.7
  pour Bottom (isolate 0.406): 107,79.35 159.7,79.38 159.7,0.32 107,0.32
  pour Bottom (isolate 0.406): 93.34,0.32 113.35,0.32 113.35,35.88 93.34,35.88
  pour Bottom (isolate 0.406): 93.66,42.55 93.66,18.73 77.47,18.73 77.47,42.55
  pour Bottom (isolate 0.406): 86.04,74.3 88.27,76.52 88.27,79.06 86.04,81.28
  pour Bottom (isolate 0.406): 85.72,99.69 93.34,99.69 93.34,91.76 85.72,91.76
  pour Bottom (isolate 0.406): 93.66,93.98 89.53,93.98 89.53,83.82 90.81,82.55 90.81,75.56 89.53,74.3 89.53,70.17 90.49,69.22 90.49,65.09 93.66,65.09
  pour Bottom (isolate 0.406): 33.66,0.32 33.66,36.2 0,36.2 0,0.32
  pour Bottom (isolate 0.406): 0,48.58 14.29,48.58 14.29,35.56 0,35.56
  pour Bottom (isolate 0.406): 42.86,35.24 42.86,48.58 68.9,48.58 68.9,35.24
  pour Bottom (isolate 0.406): 32.07,0.32 32.07,19.68 96.52,19.68 96.52,0.32
GRUEN
  Top 0.203: R11.1 139.06,57.15 139.05,57.16 R12.1 139.06,59.05 139.05,59.07 R13.1 139.7,60.96 140.65,61.91 140.65,65.09 141.7,66.14 CN6.2
INT
  Top 0.203: IC1.63 85.21,40.84 88.9,37.15 94.3,37.15 95.89,38.73 104.78,38.73 105.41,38.1 105.41,29.21 106.68,27.94 107.95,27.94 108.58,27.3 108.58,26.04 | 108.58,26.04 108.58,26.35 | D5.3 107.63,25.08 108.58,26.04 | 108.58,26.04 R20.2
IORQ  (via drill 0.61)
  Top 0.203: U$1.18 48.26,6.67 46.67,5.08 8.26,5.08 3.49,9.84 3.49,75.25 X1.IORQ | v80.01,7.62 80.01,18.1 79.06,19.05 IC4.5
  Bottom 0.203: U$1.18 48.26,9.84 51.12,6.99 60.64,6.99 61.59,7.94 78.74,7.94 79.06,7.62 v80.01,7.62
MREQ  (via drill 0.61)
  Top 0.203: U$1.19 50.8,6.03 49.21,4.45 8.26,4.45 2.86,9.84 2.86,77.15 3.81,78.11 11.75,78.11 12.7,79.06 12.7,82.87 11.11,84.45 X1.MREQ | v82.55,8.57 82.55,18.41 81.6,19.37 IC4.7
  Bottom 0.203: U$1.19 50.8,8.89 52.07,7.62 60.33,7.62 61.28,8.57 v82.55,8.57
N$1  (via drill 0.61)
  Top 0.203: IC1.24 65.61,50.27 v65.09,50.8 | IC8.3 52.07,54.93 v56.2,50.8
  Bottom 0.203: v56.2,50.8 v65.09,50.8
N$2
  Bottom 0.61: PAD1.1 8.26,6.67
  Bottom 1.016: X1.+5V 5.08,9.84 8.26,6.67
N$3
  Top 0.203: 62.87,80.01 LD2.1 63.03,77.94 63.18,77.79 R24.1
N$4
  Top 0.254: IC6.14 107.63,33.34 106.68,32.38 106.68,29.84 107.31,29.21 112.71,29.21 113.67,28.26 113.67,26.35 114.62,25.4 143.83,25.4 145.1,24.13 147.32,24.13 148.59,25.4 148.59,26.35 149.54,26.99 X3.7
N$5
  Top 0.254: IC6.13 107.95,34.61 106.05,32.7 106.05,29.53 107,28.57 112.39,28.57 113.03,27.94 113.03,26.04 114.3,24.77 142.24,24.77 145.73,21.27 149.86,21.27 151.13,22.54 151.13,27.94 149.54,29.53 X3.8
N$7  (via drill 0.61)
  Top 0.254: R4.2 124.46,71.75 129.22,71.75 | 129.22,71.75 130.81,71.75 | R7.1 v130.81,69.85 | v133.35,81.28 132.4,80.33 132.4,77.15 131.76,76.52 129.86,76.52 129.22,75.88 129.22,71.75 | v136.53,85.09 136.84,85.48 145.49,85.48 145.73,85.72 151.45,91.44 CN2.A2
  Top 0.406: 130.81,71.75 R7.1
  Bottom 0.254: v136.53,85.09 133.35,81.92 v133.35,81.28
N$8
  Top 0.254: IC6.1 122.56,30.8 123.19,30.16 124.78,30.16 C54.2 124.78,30.24
N$9  (via drill 0.61)
  Top 0.254: R5.2 124.46,77.79 125.41,77.79 125.73,77.47 R6.1 | R6.1 130.81,80.64 v132.4,82.23 | v136.53,86.36 139.06,88.9 141.92,88.9 143.19,90.17 145.1,90.17 148.59,93.66 CN2.A6
  Top 0.406: R6.1
  Bottom 0.254: v132.4,82.23 v136.53,86.36
N$10
  Top 0.203: R8.1 131.46,86.37
  Top 0.254: R1.2 124.47,86.37 R8.1 | 131.46,86.37 132.4,87.31 134.94,87.31 137.48,89.85 141.92,89.85 142.56,90.49 143.51,91.44 CN2.B2
N$11
  Top 0.254: R3.2 124.46,92.39 130.81,92.39 132.08,93.66 CN2.B6
  Top 0.406: 130.81,92.39 R9.1
N$18
  Bottom 1.016: PAD2.1 X1.+5V@1
N$20
  Top 0.254: IC6.3 122.24,33.34 123.51,32.07 124.78,32.07 | 124.78,32.07 124.78,32.12 | 124.78,32.07 C54.1
N$22
  Top 0.254: IC6.4 122.56,34.61 123.19,33.97 124.78,33.97 C53.2 124.78,34.05
N$23
  Top 0.254: 125.09,35.88 125.09,35.93 | 125.09,35.88 C53.1 | IC6.5 125.09,35.88
N$27
  Top 0.203: R20.1 108.58,23.18 107.11,21.71 JP1.1
N$28
  Top 0.203: 113.35,84.45 C12.2 | R21.1 C12.2 | CN1.3 114.3,88.58 113.03,87.31 C12.2 | CN1.1 113.53,95.7 113.73,95.5 CN1.4
  Bottom 0.254: CN1.4 116.96,94.73 JP2.2 113.98,91.12 CN1.3
N$30
  Top 0.203: R22.1 140.34,48.26 141.29,49.21 141.29,56.52 142.56,57.78 148.91,57.78 149.86,58.74 149.86,62.55 151.13,63.82 CN6.13
N$36
  Top 0.203: R23.1 140.97,46.35 141.92,47.31 141.92,56.52 142.56,57.15 151.45,57.15 152.72,58.42 152.72,60.01 151.13,61.59 CN6.14
N$37  (via drill 0.81 pad 1.42)
  other vias: 20.32,85.09
N$38  (via drill 0.81 pad 1.42)
  other vias: 22.86,85.09
N$39  (via drill 0.81 pad 1.42)
  other vias: 25.4,85.09
N$40  (via drill 0.81 pad 1.42)
  other vias: 27.94,85.09
N$41  (via drill 0.81 pad 1.42)
  other vias: 30.48,85.09
N$42  (via drill 0.81 pad 1.42)
  other vias: 33.02,85.09
N$44  (via drill 0.81 pad 1.42)
  other vias: 35.56,82.55
N$46  (via drill 0.81 pad 1.42)
  other vias: 33.02,82.55
N$47  (via drill 0.81 pad 1.42)
  other vias: 30.48,82.55
N$48  (via drill 0.81 pad 1.42)
  other vias: 27.94,82.55
N$49  (via drill 0.81 pad 1.42)
  other vias: 25.4,82.55
N$50  (via drill 0.81 pad 1.42)
  other vias: 22.86,82.55
N$51  (via drill 0.81 pad 1.42)
  other vias: 20.32,82.55
N$52  (via drill 0.81 pad 1.42)
  other vias: 17.78,82.55
N$53  (via drill 0.81 pad 1.42)
  other vias: 17.78,80.01
N$54  (via drill 0.81 pad 1.42)
  other vias: 17.78,77.47
N$55  (via drill 0.81 pad 1.42)
  other vias: 17.78,74.93
N$56  (via drill 0.81 pad 1.42)
  other vias: 17.78,72.39
N$57  (via drill 0.81 pad 1.42)
  other vias: 17.78,69.85
N$58  (via drill 0.81 pad 1.42)
  other vias: 17.78,67.31
N$59  (via drill 0.81 pad 1.42)
  other vias: 17.78,64.77
N$61  (via drill 0.81 pad 1.42)
  other vias: 20.32,62.23
N$62  (via drill 0.81 pad 1.42)
  other vias: 22.86,62.23
N$63  (via drill 0.81 pad 1.42)
  other vias: 25.4,62.23
N$65  (via drill 0.81 pad 1.42)
  other vias: 27.94,62.23
N$66  (via drill 0.81 pad 1.42)
  other vias: 30.48,62.23
N$67  (via drill 0.81 pad 1.42)
  other vias: 33.02,62.23
N$69  (via drill 0.81 pad 1.42)
  other vias: 35.56,64.77
N$70  (via drill 0.81 pad 1.42)
  other vias: 35.56,67.31
N$71  (via drill 0.81 pad 1.42)
  other vias: 35.56,69.85
N$72  (via drill 0.81 pad 1.42)
  other vias: 35.56,72.39
N$73  (via drill 0.81 pad 1.42)
  other vias: 35.56,74.93
N$74  (via drill 0.81 pad 1.42)
  other vias: 35.56,77.47
N$75  (via drill 0.81 pad 1.42)
  other vias: 35.56,80.01
N$76  (via drill 0.81 pad 1.42)
  other vias: 20.32,64.77
N$77  (via drill 0.81 pad 1.42)
  other vias: 22.86,64.77
N$78  (via drill 0.81 pad 1.42)
  other vias: 25.4,64.77
N$79  (via drill 0.81 pad 1.42)
  other vias: 27.94,64.77
N$80
  Top 0.203: R127.1 65.72,77.79 66.84,78.91 LD1.1
N$81  (via drill 0.81 pad 1.42)
  other vias: 30.48,64.77
N$82  (via drill 0.81 pad 1.42)
  other vias: 20.32,80.01
N$83  (via drill 0.81 pad 1.42)
  other vias: 20.32,77.47
N$84  (via drill 0.81 pad 1.42)
  other vias: 20.32,74.93
N$85  (via drill 0.81 pad 1.42)
  other vias: 20.32,72.39
N$86  (via drill 0.81 pad 1.42)
  other vias: 20.32,69.85
N$87  (via drill 0.81 pad 1.42)
  other vias: 20.32,67.31
N$88  (via drill 0.81 pad 1.42)
  other vias: 22.86,67.31
N$89
  Top 0.203: Q1.3 68.9,78.11 68.42,78.59 LD1.2
N$90  (via drill 0.81 pad 1.42)
  other vias: 25.4,67.31
N$91  (via drill 0.81 pad 1.42)
  other vias: 27.94,67.31
N$92
  Top 0.203: Q1.1 67.95,75.88 67.94,75.88 67.99,75.84 R126.2
N$93  (via drill 0.81 pad 1.42)
  other vias: 30.48,67.31
N$94  (via drill 0.81 pad 1.42)
  other vias: 33.02,67.31
N$95  (via drill 0.81 pad 1.42)
  other vias: 33.02,69.85
N$96  (via drill 0.81 pad 1.42)
  other vias: 33.02,72.39
N$97  (via drill 0.81 pad 1.42)
  other vias: 33.02,74.93
N$98  (via drill 0.81 pad 1.42)
  other vias: 33.02,77.47
N$99  (via drill 0.81 pad 1.42)
  other vias: 33.02,80.01
N$100  (via drill 0.81 pad 1.42)
  other vias: 30.48,80.01
N$101  (via drill 0.81 pad 1.42)
  other vias: 27.94,80.01
N$103  (via drill 0.81 pad 1.42)
  other vias: 25.4,80.01
N$104  (via drill 0.81 pad 1.42)
  other vias: 22.86,80.01
N$105  (via drill 0.81 pad 1.42)
  other vias: 22.86,77.47
N$106  (via drill 0.81 pad 1.42)
  other vias: 22.86,74.93
N$107  (via drill 0.81 pad 1.42)
  other vias: 22.86,72.39
N$108  (via drill 0.81 pad 1.42)
  other vias: 22.86,69.85
N$109  (via drill 0.81 pad 1.42)
  other vias: 25.4,69.85
N$110  (via drill 0.81 pad 1.42)
  other vias: 27.94,69.85
N$111  (via drill 0.81 pad 1.42)
  other vias: 30.48,69.85
N$112  (via drill 0.81 pad 1.42)
  other vias: 33.02,64.77
N$113  (via drill 0.81 pad 1.42)
  other vias: 30.48,72.39
N$114  (via drill 0.81 pad 1.42)
  other vias: 30.48,74.93
N$115  (via drill 0.81 pad 1.42)
  other vias: 30.48,77.47
N$116  (via drill 0.81 pad 1.42)
  other vias: 27.94,77.47
N$117  (via drill 0.81 pad 1.42)
  other vias: 25.4,77.47
N$118  (via drill 0.81 pad 1.42)
  other vias: 25.4,74.93
N$119  (via drill 0.81 pad 1.42)
  other vias: 25.4,72.39
N$120  (via drill 0.81 pad 1.42)
  other vias: 27.94,72.39
N$121  (via drill 0.81 pad 1.42)
  other vias: 27.94,74.93
NA0
  Top 0.203: IC5.18 61.28,36.83 62.23,37.78 73.34,37.78 76.71,41.15 IC1.46
NA1
  Top 0.203: IC5.17 62.55,36.2 63.5,37.15 73.34,37.15 77.21,41.02 IC1.47
NA2
  Top 0.203: IC5.16 63.82,35.56 64.77,36.51 73.34,36.51 77.71,40.88 IC1.48
NA3
  Top 0.203: IC5.15 65.09,34.92 66.04,35.88 73.34,35.88 78.71,41.25 IC1.50
NA4
  Top 0.203: IC5.14 66.36,34.29 67.31,35.24 73.34,35.24 79.21,41.11 IC1.51
NA5
  Top 0.203: IC5.13 67.63,33.66 68.58,34.61 73.34,34.61 79.71,40.98 IC1.52
NA6
  Top 0.203: IC5.12 68.9,33.02 69.85,33.97 73.34,33.97 80.21,40.84 IC1.53
NA7
  Top 0.203: IC5.11 70.17,32.7 70.8,33.34 73.34,33.34 81.21,41.21 IC1.55
NCLK
  Top 0.203: IC1.59 83.21,37.17 79.06,33.02 IC4.16
ND0
  Top 0.203: IC7.18 46.04,32.7 59.11,45.77 IC1.33
ND1
  Top 0.203: IC7.17 47.31,32.38 60.2,45.27 IC1.34
ND2
  Top 0.203: IC1.35 70.17,44.77 60.33,44.77 48.58,33.02 IC7.16
ND3
  Top 0.203: IC1.40 73.71,41.33 73.34,40.96 58.1,40.96 49.85,32.7 IC7.15
ND4
  Top 0.203: IC1.41 74.21,41.19 73.34,40.32 58.1,40.32 51.12,33.34 IC7.14
ND5
  Top 0.203: IC1.42 74.71,41.06 73.34,39.69 58.1,39.69 52.39,33.97 IC7.13
ND6
  Top 0.203: IC1.43 75.21,40.92 73.34,39.05 58.1,39.05 53.66,34.61 IC7.12
ND7
  Top 0.203: IC1.45 76.21,41.29 73.34,38.42 58.1,38.42 54.93,35.24 IC7.11
NDIR  (via drill 0.61)
  Top 0.203: v40.64,29.53 40.64,30.8 42.55,32.7 42.55,34.61 43.81,35.88 47.94,35.88 58.84,46.77 IC1.31
  Top 0.254: IC7.1 43.5,21.59
  Top 0.305: IC7.1 v43.5,24.77
  Bottom 0.203: v43.5,24.77 43.5,26.67 v40.64,29.53
NEN
  Top 0.203: IC7.19 44.77,32.07 58.97,46.27 IC1.32
NIORQ
  Top 0.203: IC1.60 83.71,36.41 80.33,33.02 IC4.15
NRD
  Top 0.203: IC1.57 82.21,38.4 76.52,32.7 IC4.18
NRESET
  Top 0.203: IC1.62 84.71,36.13 81.6,33.02 IC4.14
NWR
  Top 0.203: IC1.58 82.71,37.95 77.79,33.02 IC4.17
PS2_CLK1
  Top 0.203: R5.1 125.42,75.89 125.73,76.2 127.64,76.2 | 124.46,75.88 108.27,75.88 106.36,73.98 106.36,58.42 97.72,49.77 IC1.84
  Top 0.254: 124.46,75.88 R5.1
  Top 0.406: 127.64,76.2 D3.3
PS2_CLK2
  Top 0.203: D2.3 127.64,91.12 126.36,91.12 125.74,90.5 R3.1 124.46,90.49 123.19,90.49 121.6,88.9 121.6,82.87 120.65,81.92 107,81.92 105.09,80.01 105.09,58.42 97.94,51.27 IC1.87
PS2_DAT1
  Top 0.203: R4.1 125.42,73.65 126.05,73.03 127.64,73.03 | R4.1 108.9,73.66 107,71.75 107,58.42 97.85,49.27 IC1.83
  Top 0.254: R4.1
  Top 0.406: 127.64,73.03 D4.3
PS2_DAT2
  Top 0.203: D1.3 127.64,87.63 126.36,87.63 125.74,88.25 R1.1 124.46,88.27 123.51,88.27 122.24,87 122.24,82.87 120.65,81.28 107.63,81.28 105.73,79.38 105.73,58.42 98.08,50.77 IC1.86
RD  (via drill 0.61)
  Top 0.203: v74.93,6.35 74.93,13.34 75.25,13.65 IC4.2 | U$1.16 44.45,9.53 44.45,6.67 43.5,5.71 8.26,5.71 6.35,7.62 6.35,12.38 7.3,13.34 7.3,66.36 X1.RD
  Bottom 0.203: U$1.16 43.18,8.26 45.72,5.71 61.28,5.71 62.23,6.67 74.61,6.67 v74.93,6.35
RESET  (via drill 0.61)
  Top 0.203: U$1.28 73.66,5.71 71.75,3.81 8.26,3.81 2.22,9.84 2.22,79.69 3.17,80.64 11.11,80.64 11.75,81.28 11.75,82.55 11.11,83.19 8.89,83.19 8.26,83.82 8.26,86.04 9.21,87 X1.RESET | IC4.6 80.33,19.37 81.28,18.41 v81.28,13.34
  Bottom 0.203: U$1.28 73.66,12.7 74.3,13.34 v81.28,13.34
ROT
  Top 0.203: R14.1 139.06,63.5 139.05,63.51 R15.1 139.06,65.41 R15.1 R16.1 139.06,67.31 139.06,67.94 139.38,68.26 139.54,68.42 CN6.1
RTS_FPGA
  Top 0.203: IC6.11 109.22,37.15 106.36,40.01 95.89,40.01 94.3,38.42 88.9,38.42 86.71,40.6 IC1.66
RXD
  Top 0.203: 124.14,26.35 144.46,26.35 145.41,25.4 147,25.4 X3.2
  Top 0.254: IC6.8 118.75,39.69 117.79,38.73 117.79,32.38 115.89,30.48 115.89,26.99 116.52,26.35 124.14,26.35
RXD_FPGA
  Top 0.203: IC1.69 88.21,40.38 88.9,39.69 94.3,39.69 95.89,41.27 106.36,41.27 107.95,39.69 IC6.9
SLEEPN  (via drill 0.61)
  Top 0.203: ST3.7 33.66,92.39 45.72,80.33 45.72,65.41 61.28,49.85 v61.28,48.26 | v61.28,43.81 61.28,42.55 62.23,41.59 66.99,41.59 67.3,41.9 R2.1 68.9,42.86 69.49,42.27 IC1.37
  Bottom 0.203: v61.28,43.81 v61.28,48.26
SRAM_A0
  Top 0.203: IC2.1 79.38,69.22 | IC1.131 78.71,67.6 79.38,68.26 IC2.1 | IC2.1 79.38,74.93 78.42,75.88 78.42,81.6 79.38,82.55 IC3.1 79.38,84.77
SRAM_A1
  Top 0.203: IC1.129 79.71,67.01 80.64,67.94 IC2.2 80.64,74.93 | 80.64,74.93 80.66,73.33 | 80.64,74.93 80.01,75.56 80.01,81.6 80.64,82.23 IC3.2
SRAM_A2
  Top 0.203: IC1.126 81.21,66.92 81.92,67.63 81.92,69.85 81.93,69.85 | 81.93,69.85 IC2.3 | 81.93,69.85 81.93,74.92 81.28,75.56 81.28,81.6 81.92,82.23 IC3.3 81.92,84.77
SRAM_A3
  Top 0.203: IC1.124 82.21,66.66 83.19,67.63 IC2.4 83.19,74.93 82.55,75.56 82.55,81.6 83.19,82.23 IC3.4 83.19,84.77
SRAM_A4
  Top 0.203: 94.61,84.77 IC3.13 94.61,82.23 93.98,81.6 93.98,75.56 94.61,74.93 IC2.13 94.61,68.26 98.42,64.45 98.42,60.64 95.56,57.77 IC1.100
SRAM_A5
  Top 0.203: 95.9,84.95 IC3.14 95.89,82.23 95.25,81.6 95.25,75.56 95.89,74.93 IC2.14 95.89,68.26 99.69,64.45 99.69,60.33 95.64,56.27 IC1.97
SRAM_A6
  Top 0.203: 97.16,84.77 IC3.15 97.16,82.23 96.52,81.6 96.52,75.56 97.16,74.93 IC2.15 97.16,68.26 100.97,64.45 100.97,60.33 95.91,55.27 IC1.95
SRAM_A7
  Top 0.203: 98.42,84.77 IC3.16 98.42,82.23 97.79,81.6 97.79,75.56 98.42,74.93 IC2.16 98.42,68.26 102.23,64.45 102.23,60.33 96.18,54.27 IC1.93
SRAM_A8
  Top 0.203: IC3.17 98.44,94.79 | IC2.17 98.42,79.69 | IC2.17 98.42,75.56 99.06,74.93 99.06,68.26 102.87,64.45 102.87,60.33 96.32,53.77 IC1.92 | IC2.17 98.42,81.6 99.38,82.55 99.38,89.22 98.42,90.17 IC3.17 | IC3.17 98.42,94.61
SRAM_A9
  Top 0.203: IC3.18 97.17,94.79 | IC3.18 97.16,94.61 | IC3.18 97.16,90.17 97.79,89.53 97.79,82.23 97.16,81.6 IC2.18 97.16,75.56 97.79,74.93 97.79,68.26 101.6,64.45 101.6,60.33 96.05,54.77 IC1.94
SRAM_A10
  Top 0.203: 95.9,94.79 IC3.19 95.89,90.17 96.52,89.53 96.52,82.23 95.89,81.6 IC2.19 95.89,75.56 96.52,74.93 96.52,68.26 100.33,64.45 100.33,60.33 95.78,55.77 IC1.96
SRAM_A11
  Top 0.203: 94.63,94.79 IC3.20 94.61,90.17 95.25,89.53 95.25,82.23 94.61,81.6 IC2.20 94.61,75.56 95.25,74.93 95.25,68.26 99.06,64.45 99.06,60.64 95.69,57.27 IC1.99
SRAM_A12
  Top 0.203: 93.36,94.79 IC3.21 93.34,90.17 93.98,89.53 93.98,82.23 93.34,81.6 IC2.21 93.34,75.56 93.98,74.93 93.98,68.26 97.79,64.45 97.79,60.96 95.6,58.77 IC1.102
SRAM_A13
  Top 0.203: IC3.29 83.2,94.79 | IC1.123 82.71,66.52 83.82,67.63 83.82,74.93 83.19,75.56 IC2.29 | IC2.29 83.19,79.69 | IC2.29 83.19,81.6 83.82,82.23 83.82,86.04 83.19,86.68 IC3.29 | IC3.29 83.19,94.61
SRAM_A14
  Top 0.203: IC1.125 81.71,66.79 82.55,67.63 82.55,74.93 81.92,75.56 IC2.30 | IC2.30 81.92,79.69 | IC2.30 81.92,81.6 82.55,82.23 82.55,89.53 81.92,90.17 IC3.30 81.92,94.61
SRAM_A15
  Top 0.203: IC1.128 80.21,66.88 81.28,67.94 81.28,74.93 80.64,75.56 IC2.31 80.64,81.6 81.28,82.23 81.28,89.53 80.64,90.17 IC3.31
SRAM_A16
  Top 0.203: IC1.130 79.21,67.15 80.01,67.94 80.01,74.93 79.38,75.56 IC2.32 79.38,81.6 80.01,82.23 80.01,89.53 79.38,90.17 IC3.32
SRAM_CE
  Top 0.203: IC1.122 83.21,66.39 84.45,67.63 IC2.5
SRAM_CE1  (via drill 0.61)
  Top 0.203: v84.45,87.63 IC3.5 | IC1.132 78.21,75.46 77.79,75.88 v77.79,87.63
  Bottom 0.203: v77.79,87.63 v84.45,87.63
SRAM_D0
  Top 0.203: IC1.118 85.21,66.8 85.72,67.31 IC2.6 85.72,71.12 85.41,71.44 85.41,74.93 84.45,75.88 84.45,77.79 85.09,78.42 85.09,81.6 85.72,82.23 IC3.6 85.72,84.77
SRAM_D1
  Top 0.203: IC1.116 86.21,66.53 87,67.31 IC2.7 87,71.12 86.68,71.44 86.68,74.93 85.72,75.88 85.72,77.79 86.36,78.42 86.36,81.6 87,82.23 IC3.7
SRAM_D2
  Top 0.203: IC1.114 87.21,66.26 88.9,67.94 90.17,67.94 90.81,68.58 IC2.10 90.81,74.93 90.17,75.56 90.17,81.6 90.81,82.23 IC3.10
SRAM_D3
  Top 0.203: IC1.105 95.2,60.27 95.89,60.96 95.89,64.45 92.08,68.26 IC2.11 92.08,74.93 91.44,75.56 91.44,81.6 92.08,82.23 IC3.11 92.08,84.77
SRAM_D4
  Top 0.203: 92.09,94.79 IC3.22 92.08,90.17 92.71,89.53 92.71,82.23 92.08,81.6 92.08,79.38 | 92.08,79.69 IC2.22 92.08,79.38 | 92.08,79.38 92.08,75.56 92.71,74.93 92.71,68.26 96.52,64.45 96.52,60.96 95.33,59.77 IC1.104
SRAM_D5
  Top 0.203: 90.82,94.79 IC3.23 90.81,90.17 91.44,89.53 91.44,82.23 90.81,81.6 90.81,79.38 | IC1.113 87.71,66.12 88.9,67.31 90.81,67.31 91.44,67.94 91.44,74.93 90.81,75.56 90.81,79.38 | 90.81,79.69 IC2.23 90.81,79.38
SRAM_D6
  Top 0.203: IC3.26 87.01,94.79 | IC1.115 86.71,66.39 87.63,67.31 87.63,71.12 87.31,71.44 87.31,74.93 86.36,75.88 86.36,77.79 87,78.42 IC2.26 87,81.6 87.63,82.23 87.63,86.04 87,86.68 IC3.26 | IC3.26 87,94.61
SRAM_D7
  Top 0.203: IC1.117 85.71,66.66 86.36,67.31 86.36,71.12 86.04,71.44 86.04,74.93 85.09,75.88 85.09,77.79 85.72,78.42 IC2.27 85.72,81.6 86.36,82.23 86.36,89.53 85.72,90.17 IC3.27
SRAM_OE
  Top 0.203: IC1.120 84.21,66.75 85.09,67.63 85.09,71.12 84.77,71.44 84.77,74.93 83.82,75.88 83.82,77.79 84.45,78.42 IC2.28 84.45,81.6 85.09,82.23 85.09,86.04 85.72,86.68 85.72,88.9 84.45,90.17 IC3.28 84.45,94.61
SRAM_RW
  Top 0.203: 93.36,84.95 IC3.12 93.34,82.23 92.71,81.6 92.71,75.56 93.34,74.93 IC2.12 93.34,68.26 97.16,64.45 97.16,60.96 95.47,59.27 IC1.103
TXD
  Top 0.254: IC6.7 122.24,38.42 122.56,38.73 126.05,38.73 126.68,38.1 126.68,29.21 128.91,26.99 144.46,26.99 145.73,28.26 X3.3
TXD_FPGA
  Top 0.203: IC6.10 108.58,38.42 106.36,40.64 95.89,40.64 94.3,39.05 88.9,39.05 87.21,40.74 IC1.67
V+_IC1
  Top 0.254: 120.97,32.07 IC6.2 118.75,32.07 116.84,30.16 C55.1
V-_IC1
  Top 0.254: IC6.6 122.56,37.15 123.19,37.78 124.78,37.78 C52.2 124.78,37.86
VCC  (via drill 0.61, 0.81 pad 1.42)  (2 unrouted)
  Top 0.203: IC1.36 65.86,44.27 65.41,43.81 65.41,42.86 R2.2 | C4.2 59.1,33.02 59.05,33.02 59.05,32.7 | 73.98,20.64 IC4.1 | v41.91,30.8 41.96,30.75 | 73.21,62.87 73.21,62.36 v73.34,62.23 | 73.21,62.87 IC1.142 | 73.21,62.87 72.71,62.87 IC1.143 72.71,63.82 72.71,65.41 71.44,66.67 69.85,66.67 | 69.85,67.64 69.85,67.63 | 69.85,67.64 69.85,71.75 69.22,72.39 66.36,72.39 65.72,73.03 R127.2 63.2,75.89 63.18,75.88 R24.2 | IC8.4 41.86,54.98 | v104.14,30.8 104.14,29.84 105.88,28.11 D5.2 | R58.2 67.94,67.63 68.9,66.67 69.85,66.67 | 69.85,66.67 69.85,67.64 | IC9.2@1 24.13,38.42 24.77,38.42
  Top 0.254: IC5.1 58.74,21.59 | IC1.36 71.93,44.27 v72.07,44.13 73.03,44.13 73.21,43.95 IC1.39 | IC1.19 71.19,52.77 v71.75,53.34 v71.75,54.61 71.12,55.24 71.09,55.24 71.09,55.27 IC1.14 | IC1.8 71.29,58.27 v71.75,58.74 | IC1.133 77.71,62.47 v77.47,62.23 | IC1.119 84.71,62.92 85.41,62.23 v86.36,62.23 v87.63,62.23 88.21,62.81 IC1.112 | IC1.108 90.67,61.77 89.85,60.96 v89.85,60.33 90.3,60.77 IC1.106 | IC1.98 90.75,56.77 v90.17,56.2 v90.17,53.98 90.87,53.27 IC1.91 | IC1.73 90.67,44.27 v89.85,45.09 | 84.14,43.5 v83.82,43.81 | 84.14,43.5 84.22,43.41 | IC1.61 84.21,43.42 84.14,43.5 | C55.2 114.95,28.88 v113.03,30.8 | IC1.88 90.19,51.77 v89.85,51.44 | IC1.49 78.21,42.97 79.06,43.81 v79.38,43.81 | IC1.68 87.71,43.1 v87,43.81
  Top 0.305: IC5.1 v58.74,22.86 | v73.98,28.57 IC4.20 | v58.74,28.57 IC5.20 58.74,32.38 59.05,32.7 | 88.27,71.44 v88.27,71.75 | IC4.1 v73.98,22.86 | C1.2 73.03,19.68 73.98,20.64 | C31.2 43.5,33.66 IC7.20
  Top 0.406: 126.68,93.66 126.69,93.66 D2.2 126.69,93.34 126.68,93.34 126.69,93.35 v126.69,95.25 v126.68,95.25 | v126.68,80.33 v126.69,80.33 | D4.2 128.59,70.48 v128.59,68.9 128.59,67.63 v123.51,62.55 | IC2.8 88.27,71.44 | IC3.8 88.27,86.68 v87.95,87 | v89.53,91.44 IC3.24 | IC2.24 89.53,77.47 v89.22,77.15 | v126.68,80.33 126.68,81.6 v128.59,83.5 128.59,85.09 D1.2 | D3.2 126.69,78.74 126.68,78.74 v126.68,80.33 | SV1.6 113.98,54.61 109.86,54.61 107.95,52.7 v105.73,52.7 | 41.96,30.75 IC7.20 | IC8.4 IC8.1 41.91,47.31 v41.27,46.67 | 41.86,54.98 C2.2
  Top 0.61: v107.63,30.8 IC6.16 112.39,30.8 | 112.39,30.8 v113.03,30.8 | 112.39,30.8 112.5,30.7 | v83.5,26.35 v94.93,26.35
  Top 1.016: IC9.2 v24.13,32.38 v24.13,37.78 24.77,38.42 | v19.37,91.44 v18.73,90.81 15.56,87.63 15.56,63.18 16.51,62.23 | 16.51,62.23 v17.78,62.23 | 16.51,62.23 15.56,61.28 v15.56,55.56 v15.56,54.61
  Bottom 0.203: 14.92,47.62 15.24,47.94 | 114.65,32.42 114.65,31.46 114.62,31.43
  Bottom 0.305: 88.55,73.34 88.58,73.34 | v58.74,28.57 58.74,29.84 | 15.24,47.94 15.24,48.26
  Bottom 0.406: 36.2,29.53 35.88,29.21 | 37.15,29.21 36.83,29.53 | v128.59,83.5 128.59,93.34 v126.68,95.25 | v128.59,68.9 128.59,78.42 v126.68,80.33 | 114.65,32.42 115.25,33.02 115.25,33.66 115.39,33.66 C5.2 | 123.51,62.23 v123.51,62.55 118.51,57.55 C3.2 118.43,55.9 118.43,55.88 SV1.6
  Bottom 0.61: 77.15,26.35 76.52,26.35 | 77.15,26.35 v83.5,26.35 | v94.93,26.35 99.69,26.35 v104.14,30.8 v107.63,30.8 | 114.65,31.43 114.62,31.43 113.98,30.8 v113.03,30.8 | 91.44,52.7 v105.73,52.7 | C57.1 24.02,32.5 v24.13,32.38 24.12,32.37 24.12,31.13 24.13,31.11 24.12,31.11 C59.2 | 77.15,26.35 76.83,26.67 | 76.83,26.04 77.15,26.35
  Bottom 1.016: 72.07,28.57 71.44,29.21 71.44,43.18 | C66.2 88.55,73.34 | v18.73,90.81 v19.37,91.44 23.5,95.57 ST3.2 | ST3.2 26.35,95.57 | ST3.2 ST3.4 | 88.58,90.49 v89.53,91.44 | 15.56,48.26 15.56,46.99 | 15.56,48.26 v15.56,54.61 v15.56,55.56 | 90.49,62.87 89.53,63.82 | 68.58,34.29 69.85,35.56 | 43.18,34.29 41.91,35.56 | 34.61,36.2 33.97,36.83 | 16.51,47.31 15.56,48.26
  other vias: 19.68,42.23 21.91,42.23 24.13,42.23 26.35,42.23 28.57,42.23 19.68,40.01 21.91,40.01 24.13,40.01 26.35,40.01 28.57,40.01 19.68,37.78 21.91,37.78 26.35,37.78 28.57,37.78
  pour Bottom (isolate 0.406): 34.29,34.61 76.83,34.61 76.83,20.32 34.29,20.32
  pour Bottom (isolate 0.406): 69.53,43.5 69.53,28.89 76.83,28.89 76.83,43.5
  pour Bottom (isolate 0.406): 69.53,63.18 92.08,63.18 92.08,43.18 69.53,43.18
  pour Bottom (isolate 0.406): 88.9,91.12 86.68,91.12 86.68,81.6 88.9,79.38 88.9,76.2 86.68,73.98 86.68,63.18 89.85,63.18 89.85,68.9 88.9,69.85 88.9,74.61 90.17,75.88 90.17,82.23 88.9,83.5
  pour Bottom (isolate 0.406): 14.92,36.83 14.92,47.62 42.23,47.62 42.23,29.53 34.29,29.53 34.29,36.83
VCC/2  (via drill 0.61)  (1 unrouted)
  Top 0.203: C6.2 133.35,88.27 133.36,88.25 | R8.2 130.81,88.27 130.82,88.25 | 134.94,88.25 134.94,88.27
  Top 0.254: 130.81,88.27 R9.2 | 130.81,75.56 R7.2 C7.2 | 133.36,88.25 134.94,88.25 | 130.82,88.25 133.34,88.25 | 134.94,88.27 137.48,90.81 v141.29,90.81 | v141.6,84.45 137.48,84.45 v136.84,83.82 | v134.3,80.33 133.03,79.06 133.03,76.2 132.4,75.56 130.81,75.56 | 130.81,75.56 R6.2
  Top 0.406: R8.2 130.81,87.95 | 133.34,88.25 133.35,88.27
  Top 1.016: U$1.4 U$1.5 | IC9.3 26.67,28.89 v28.26,28.89 v29.21,28.89
  Top 1.27: IC9.3 26.67,26.99 25.08,25.4 16.83,25.4 15.24,23.81 U$1.5
  Bottom 0.254: v136.84,83.82 136.84,82.87 v134.3,80.33
  Bottom 1.016: PAD3.1 12.06,9.21 12.7,9.84 U$1.4 U$1.5 | v28.26,28.89 v29.21,28.89 29.21,30.8 30.48,30.8 31.43,31.75 31.43,34.18 C63.1
  Bottom 1.27: 159.07,78.74 159.07,4.45 155.89,1.27 20.95,1.27 15.24,6.99 U$1.5 | 159.07,78.74 159.07,85.41 | 138.75,99.06 34.61,99.06 33.66,98.11 ST3.8 ST3.6 | 138.75,99.06 140.97,99.06 | 159.07,78.74 157.48,80.33 | 138.75,99.06 140.65,97.16
  pour Bottom (isolate 0.406): 159.7,80.01 140.02,80.01 140.02,99.69 159.7,99.69
VGA_BL0
  Top 0.203: 135.25,54.29 134.62,53.66 134.62,50.8 128.91,45.09 97.79,45.09 97.1,45.77 IC1.76 | 135.25,54.29 135.49,54.53 | R19.2 135.57,54.61 135.25,54.29
VGA_BL1
  Top 0.203: 135.89,52.39 135.25,51.75 135.25,50.8 128.91,44.45 97.47,44.45 97.15,44.77 IC1.74 | 135.89,52.39 136.12,52.62 | R18.2 136.21,52.7 135.89,52.39
VGA_BL2
  Top 0.203: 135.57,50.48 128.91,43.81 96.52,43.81 94.3,41.59 90.17,41.59 89.71,42.05 IC1.72 | 135.57,50.48 135.81,50.72 | R17.2 135.89,50.8 135.57,50.48
VGA_GR0
  Top 0.203: 132.72,60.33 132.72,50.8 128.91,46.99 98.74,46.99 98.46,47.27 IC1.79
  Top 0.254: R13.2 133.35,60.96 132.72,60.33
VGA_GR1
  Top 0.203: 133.99,58.74 133.35,58.1 133.35,50.8 128.91,46.35 98.42,46.35 98.01,46.77 IC1.78 | 133.99,58.74 134.22,58.97 | R12.2 134.3,59.05 133.99,58.74
VGA_GR2
  Top 0.203: 134.62,56.83 133.99,56.2 133.99,50.8 128.91,45.72 98.11,45.72 97.56,46.27 IC1.77 | 134.62,56.83 134.85,57.07 | R11.2 134.94,57.15 134.62,56.83
VGA_HSYNC
  Top 0.203: R22.2 133.99,48.26 128.59,42.86 107,42.86 106.68,42.55 95.89,42.55 94.3,40.96 89.53,40.96 89.21,41.28 IC1.71
VGA_RD0
  Top 0.203: R16.2 135.25,67.31 134.3,66.36 134.3,63.82 130.81,60.33 130.81,50.8 128.91,48.9 99.38,48.9 99.25,48.77 IC1.82
VGA_RD1
  Top 0.203: 135.57,65.09 134.94,64.45 134.94,63.82 131.44,60.33 131.44,50.8 128.91,48.26 99.38,48.26 99.36,48.27 IC1.81 | 135.57,65.09 135.81,65.32 | R15.2 135.89,65.41 135.57,65.09
VGA_RD2
  Top 0.203: 134.94,63.18 132.08,60.33 132.08,50.8 128.91,47.62 99.06,47.62 98.91,47.77 IC1.80 | 134.94,63.18 135.17,63.42 | R14.2 135.25,63.5 134.94,63.18
VGA_VSYNC
  Top 0.203: R23.2 132.72,46.35 128.59,42.23 107,42.23 106.68,41.91 95.89,41.91 94.3,40.32 89.22,40.32 88.71,40.83 IC1.70
WR  (via drill 0.61)
  Top 0.203: v77.47,6.99 v77.47,16.83 77.47,17.78 76.52,18.73 IC4.3
  Bottom 0.203: U$1.17 45.72,7.94 47.31,6.35 60.96,6.35 61.91,7.3 76.83,7.3 77.15,6.99 v77.47,6.99 | X1.WR 8.26,62.23 8.26,46.04 9.21,45.09 10.79,45.09 11.75,44.13 11.75,32.07 12.06,31.75 12.06,30.48 13.34,29.21 13.34,27.3 13.97,26.67 16.83,26.67 19.37,24.13 31.75,24.13 35.56,20.32 40.01,20.32 40.96,19.37 55.24,19.37 57.15,17.46 68.26,17.46 68.9,16.83 v77.47,16.83

## Text on the board
Top: A.V. | 2007
tNames: Optional | Connector
tValues: EXTENSION | AUDIO | GDP64HS-FPGA | JTAG | INT EN